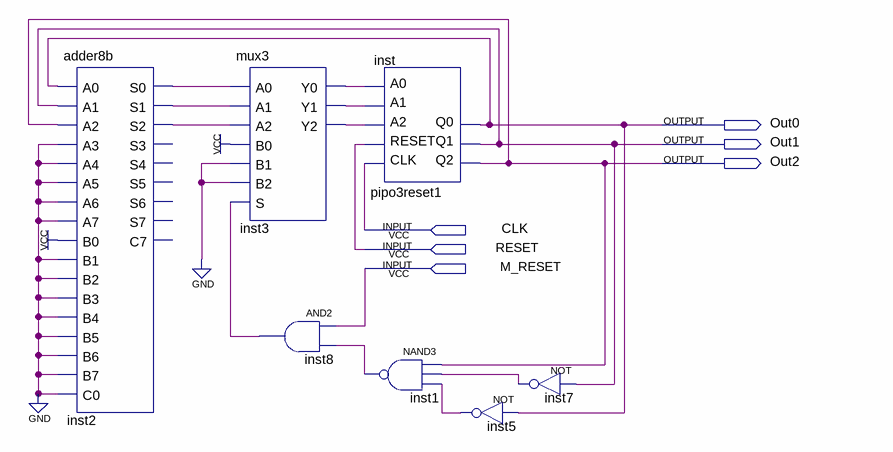
[diagram p0: schematic sheet]
// Quartus schematic count1-4.bdf as structural Verilog: 7 symbols, 6 pins
module \count1-4  (
  input  CLK,
  input  RESET,
  input  M_RESET,
  output Out0,
  output Out1,
  output Out2
);

  wire inst1_out, inst2_s0, inst2_s1, inst2_s2, inst3_y0, inst3_y1, inst3_y2, inst5_out, inst7_out, inst8_out;

  adder8b inst2 (
    .A0(Out0), .A1(Out1), .A2(Out2), .A3(1'b0), .A4(1'b0), .A5(1'b0), .A6(1'b0), .A7(1'b0), .B0(1'b1),
    .B1(1'b0), .B2(1'b0), .B3(1'b0), .B4(1'b0), .B5(1'b0), .B6(1'b0), .B7(1'b0), .C0(1'b0), .S0(inst2_s0),
    .S1(inst2_s1), .S2(inst2_s2));  // open: S3, S4, S5, S6, S7, C7
  mux3 inst3 (
    .A0(inst2_s0), .A1(inst2_s1), .A2(inst2_s2), .B0(1'b1), .B1(1'b0), .B2(1'b0), .S(inst8_out),
    .Y0(inst3_y0), .Y1(inst3_y1), .Y2(inst3_y2));
  and inst8 (inst8_out, M_RESET, inst1_out);
  pipo3reset1 inst (
    .CLK(CLK), .RESET(RESET), .A0(inst3_y0), .A1(inst3_y1), .A2(inst3_y2), .Q2(Out2), .Q1(Out1), .Q0(Out0));
  nand inst1 (inst1_out, Out2, inst7_out, inst5_out);
  not inst7 (inst7_out, Out1);
  not inst5 (inst5_out, Out0);
endmodule
